# EAGLE board digisim part 1 (EAGLE 9.6.2)
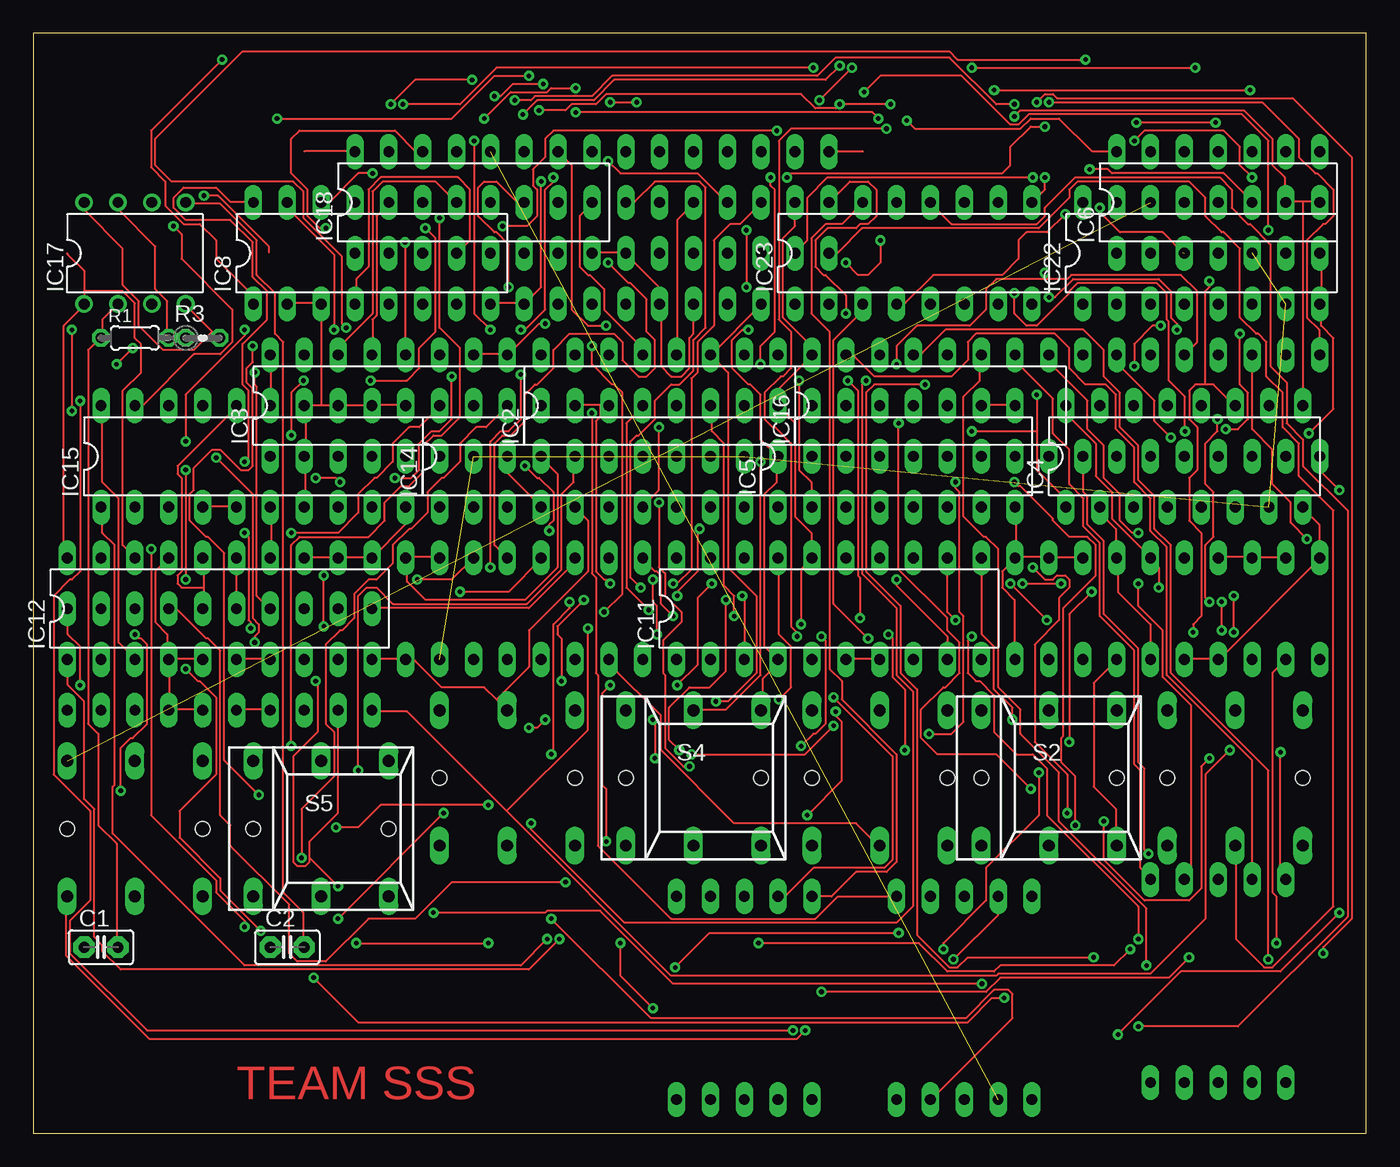
[diagram p3: board, top side]
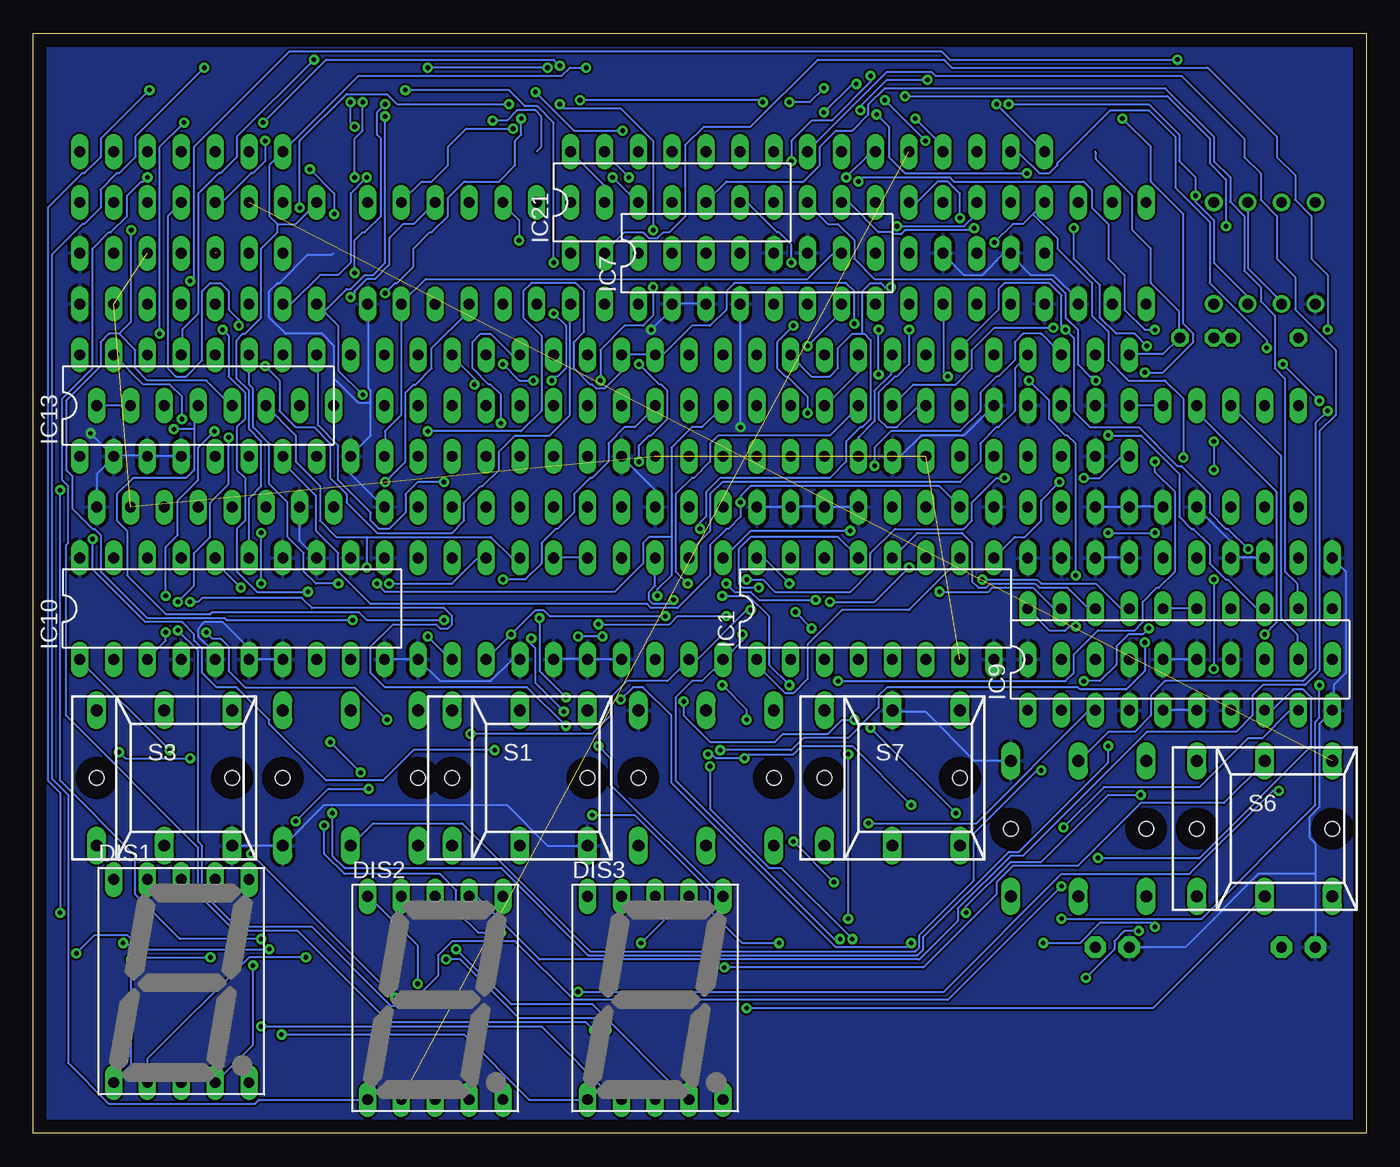
[diagram p4: board, bottom side, seen from below]

Size 100 x 82.54 mm. Coordinates in mm from the lower left corner, seen from the top.
Outline: 0,0 100,0 100,82.54 0,82.54 0,0
Copper layers (1*16): Top 0.035mm / dielectric 1.5mm / Bottom 0.035mm
Design rules "default": minimum track width 6mil, minimum drill 0.35mm, track to track 6mil, track to pad 6mil, pad to pad 6mil, via to via 6mil, smd to smd 6mil, copper to edge 40mil, drill to drill 6mil, minimum pad ring 10mil, minimum via ring 8mil, stop-mask expansion 4mil, vias tented up to drill 0mil, thermal gap 10mil

## Footprints (pad centres in the part's own frame; a part is rotated, then mirrored left to right if it is on the bottom)
C2.5-2 = drill 0.813 pad 1.6 octagon: 1 -1.27,0; 2 1.27,0
HDSP-M = drill 0.813 long: 1 -5.08,-7.62; 2 -2.54,-7.62; 3 0,-7.62; 4 2.54,-7.62; 5 5.08,-7.62; 6 5.08,7.62; 7 2.54,7.62; 8 0,7.62; 9 -2.54,7.62; 10 -5.08,7.62
DIL16 = drill 0.813 long: 1 -8.89,-3.81; 2 -6.35,-3.81; 3 -3.81,-3.81; 4 -1.27,-3.81; 5 1.27,-3.81; 6 3.81,-3.81; 7 6.35,-3.81; 8 8.89,-3.81; 9 8.89,3.81; 10 6.35,3.81; 11 3.81,3.81; 12 1.27,3.81; 13 -1.27,3.81; 14 -3.81,3.81; 15 -6.35,3.81; 16 -8.89,3.81
DIL14 = drill 0.813 long: 1 -7.62,-3.81; 2 -5.08,-3.81; 3 -2.54,-3.81; 4 0,-3.81; 5 2.54,-3.81; 6 5.08,-3.81; 7 7.62,-3.81; 8 7.62,3.81; 9 5.08,3.81; 10 2.54,3.81; 11 0,3.81; 12 -2.54,3.81; 13 -5.08,3.81; 14 -7.62,3.81
DIL20 = drill 0.813 long: 1 -11.43,-3.81; 2 -8.89,-3.81; 3 -6.35,-3.81; 4 -3.81,-3.81; 5 -1.27,-3.81; 6 1.27,-3.81; 7 3.81,-3.81; 8 6.35,-3.81; 9 8.89,-3.81; 10 11.43,-3.81; 11 11.43,3.81; 12 8.89,3.81; 13 6.35,3.81; 14 3.81,3.81; 15 1.27,3.81; 16 -1.27,3.81; 17 -3.81,3.81; 18 -6.35,3.81; 19 -8.89,3.81; 20 -11.43,3.81
DIL08 = drill 0.813 pad 1.27: 1 -3.81,-3.81; 2 -1.27,-3.81; 3 1.27,-3.81; 4 3.81,-3.81; 5 3.81,3.81; 6 1.27,3.81; 7 -1.27,3.81; 8 -3.81,3.81
0204/5 = drill 0.813 octagon: 1 -2.54,0; 2 2.54,0
0204V = drill 0.813 octagon: 1 -1.27,0; 2 1.27,0
REKN = drill 0.9 long: 0A 5.08,5.08; 0B 5.08,-5.08; 1A 0,5.08; 1B 0,-5.08; A -5.08,5.08; B -5.08,-5.08 | hole 1.1: -5.08,0; 5.08,0

## Placement (x,y rotation side)
C1  48.025uF  [C2.5-2]  5.08,13.97 0 top
C2  10nF  [C2.5-2]  19.05,13.97 0 top
DIS1  HD-H101  [HDSP-M]  88.9,11.43 0 bottom
DIS2  HD-H101  [HDSP-M]  69.85,10.16 0 bottom
DIS3  HD-H101  [HDSP-M]  53.34,10.16 0 bottom
IC1  74AC160N  [DIL16]  36.83,39.37 0 bottom
IC2  74AC160N  [DIL16]  46.99,54.61 0 top
IC3  74AC160N  [DIL16]  26.67,54.61 0 top
IC4  74AC160N  [DIL16]  86.36,50.8 0 top
IC5  74AC160N  [DIL16]  64.77,50.8 0 top
IC6  74LS74N  [DIL14]  88.9,69.85 0 top
IC7  4063N  [DIL16]  45.72,66.04 0 bottom
IC8  4063N  [DIL16]  25.4,66.04 0 top
IC9  74AC11157  [DIL20]  13.97,35.56 0 bottom
IC10  74AC11157  [DIL20]  85.09,39.37 0 bottom
IC11  74AC11157  [DIL20]  59.69,39.37 0 top
IC12  74AC11157  [DIL20]  13.97,39.37 0 top
IC13  4063N  [DIL16]  87.63,54.61 0 bottom
IC14  74AC11157  [DIL20]  41.91,50.8 0 top
IC15  74AC11157  [DIL20]  16.51,50.8 0 top
IC16  4055N  [DIL16]  67.31,54.61 0 top
IC17  LM555N  [DIL08]  7.62,66.04 0 top
IC18  4055N  [DIL16]  33.02,69.85 0 top
IC21  74AC11N  [DIL14]  52.07,69.85 0 bottom
IC22  74AC160N  [DIL16]  87.63,66.04 0 top
IC23  4055N  [DIL16]  66.04,66.04 0 top
R1  10K  [0204/5]  7.62,59.69 0 top
R3  1OK  [0204V]  12.7,59.69 0 top
S1  [REKN]  63.5,26.67 0 bottom
S2  [REKN]  76.2,26.67 0 top
S3  [REKN]  90.17,26.67 0 bottom
S4  [REKN]  49.53,26.67 0 top
S5  [REKN]  21.59,22.86 0 top
S6  [REKN]  7.62,22.86 0 bottom
S7  [REKN]  35.56,26.67 0 bottom

## Tracks (layer width: path | path; a pad name or v marks a point on that pad's centre or on a via)
GND  (via drill 0.35)
  Top 0.152: IC18.8 41.91,66.09 44.35,66.09 IC21.7 44.5,65.94 46.94,63.5 46.94,62.28 IC7.4 47.09,62.13 47.09,57.56 47.85,56.79 48.62,56.79 49.23,57.4 49.23,59.69 49.53,60 IC7.3 | IC11.6 60.96,35.61 63.4,35.61 IC11.7 | S4.0A 54.71,31.8 54.71,34.09 55.78,35.15 55.78,35.46 IC11.4 55.78,35.61 54.86,36.52 54.86,47.95 55.78,48.87 55.78,50.7 IC2.8 55.78,50.85 54.56,52.07 54.56,55.42 53.8,56.19 53.65,56.19 52.43,57.4 52.43,59.54 53.19,60.3 v53.65,60.3 | IC6.7 96.62,65.94 96.62,62.28 IC22.8 96.62,62.13 96.62,60.6 97.54,59.69 97.54,54.36 v95.71,52.53 | IC4.8 95.25,46.89 96.47,45.67 96.47,43.23 IC10.20 96.47,43.08 89,35.61 IC10.4 88.85,35.61 86.41,35.61 IC10.5 | 76.2,43.23 73.76,43.23 | 76.2,43.23 78.64,43.23 IC10.13 | 76.2,43.23 IC10.12 | 73.76,43.23 73.76,46.89 IC5.8 | 73.76,43.23 IC10.11 73.61,43.08 72.69,42.16 72.69,40.95 73.61,40.03 73.61,35.61 IC10.10 | IC4.2 80.01,46.58 81.23,45.36 81.23,43.23 IC10.14 81.38,43.08 81.38,40.64 83.82,38.2 IC10.6 | S2.0B 81.23,21.59 81.23,24.33 79.55,26.01 79.55,33.78 81.23,35.46 IC10.7 | 3.81,63.19 3.81,64.72 2.59,65.94 2.54,66.04 | 3.81,63.19 IC17.1 3.81,62.13 2.29,60.6 2.29,43.38 2.44,43.23 IC12.20 | IC8.2 19.05,62.28 21.49,62.28 IC8.3 21.64,62.13 21.64,54.66 | IC8.4 24.23,62.28 24.23,64.11 25.15,65.02 25.15,70.81 26.06,71.73 31.85,71.73 32.77,70.81 32.77,67 31.85,66.09 IC18.4 | IC12.10 25.45,35.61 27.89,35.61 IC1.8 28.04,35.46 28.65,35.46 30.63,33.48 33.83,33.48 34.75,32.56 | S7.1A 34.75,32.56 | IC3.8 35.66,50.7 35.66,49.48 38.1,47.04 IC14.4 | 22.86,43.23 20.42,43.23 IC12.13 | 22.86,43.23 25.3,43.23 IC12.11 27.89,45.67 27.89,46.89 IC15.10
  Top 0.152: 22.86,43.23 IC12.12 | IC15.11 27.89,54.66 25.45,54.66 IC15.12 25.3,54.66 22.86,54.66 | 21.64,54.66 20.42,54.66 IC15.14 20.42,54.51 20.42,50.85 IC3.2 20.42,50.7 20.42,47.04 IC15.7 | 21.64,54.66 22.86,54.66 | 22.86,54.66 IC15.13 | 10.21,31.8 12.65,31.8 IC9.6 | IC9.5 15.24,31.8 17.68,31.8 IC9.4 | IC12.4 10.21,35.61 12.65,35.61 IC12.5 | IC12.6 15.24,35.61 17.68,35.61 IC12.7 | 10.21,31.8 10.21,35.46 IC12.4 | 10.21,31.8 IC9.7 | IC15.4 12.8,47.04 15.24,47.04 IC15.5 | IC12.17 9.14,42.16 9.14,38.35 10.06,37.44 10.06,35.61 IC12.4 | IC12.14 17.83,43.23 17.83,46.89 IC15.6 | 34.75,32.56 37.19,35 37.19,37.74 41.6,42.16 41.6,45.97 40.69,46.89 IC14.5 | 3.81,63.19 6.71,63.19 7.62,62.28 7.62,59.69 8.08,59.23 8.08,57.1 6.71,55.73 6.71,44.14 7.62,43.23 IC12.18 | v46.94,52.98 46.94,48.26 45.72,47.04 IC14.7
  Bottom 0.152: IC7.3 49.53,62.28 51.97,62.28 IC7.2 52.12,62.13 52.12,61.82 v53.65,60.3 | IC14.10 53.34,48.26 IC2.8 | IC11.4 55.93,35.61 58.37,35.61 IC11.5 58.52,35.61 60.96,35.61 IC11.6 | 91.44,50.85 89,50.85 IC13.4 | 91.44,50.85 93.88,50.85 IC13.2 | 91.44,50.85 IC13.3 | IC4.8 95.25,49.48 94.03,50.7 IC13.2 | IC13.2 v95.71,52.53 | S1.0B 61.42,21.59 64.47,24.64 78.18,24.64 81.23,21.59 S2.0B S3.0B | 83.82,35.61 81.38,35.61 IC10.7 | IC10.10 73.61,35.61 71.17,35.61 IC11.10 69.49,33.93 65.68,33.93 64.16,35.46 63.55,35.46 IC11.7 | IC5.8 73.76,47.04 76.2,49.48 IC16.8 76.2,50.85 74.68,52.38 74.68,54.81 | 74.68,54.81 74.68,55.73 74.83,55.88 74.83,62.13 IC23.8 | 74.68,54.81 75.59,54.81 77.42,56.64 77.42,59.08 78.33,60 81.08,60 82.3,61.21 82.3,63.19 81.69,63.8 81.53,63.8 79.4,65.94 77.57,65.94 77.47,66.04 | IC4.2 80.01,44.45 IC10.13 | 83.82,35.61 83.82,36.37 85.8,38.35 87.17,38.35 87.63,37.9 87.63,37.29 86.41,36.07 86.41,35.61 IC10.5 | 83.82,35.61 IC10.6 | IC12.20 1.52,42.16 1.52,34.54 2.44,33.63 2.44,31.8 IC9.10 2.59,31.65 3.5,30.73 3.5,24.49 4.27,23.72 4.27,22.2 3.81,21.74 3.81,19.46 | 3.81,19.46 C1.1 | C2.1 13.56,13.97 8.08,19.46 3.81,19.46 | 26.67,65.94 27.28,65.94 28.8,64.41 30.18,64.41 31.7,65.94 IC18.4 | 26.67,65.94 25.15,64.41 23.47,64.41 21.64,62.59 21.64,62.28 IC8.3 | 26.67,65.94 IC18.2 | S5.0A 26.67,27.99 29.41,27.99 33.07,31.65 35.51,31.65 S7.1A | IC14.7 45.72,47.04 43.28,47.04 IC14.6 43.13,47.04 40.69,47.04 IC14.5 40.54,47.04 38.1,47.04 IC14.4 | IC12.14 17.83,43.23 20.27,43.23 IC12.13 | IC9.6 12.8,31.8 15.24,31.8 IC9.5 | IC12.5 12.8,35.61 15.24,35.61 IC12.6 | IC15.7 20.27,47.04 17.83,47.04 IC15.6 17.68,47.04 15.24,47.04 IC15.5
  Bottom 0.152: IC12.18 7.62,43.23 10.06,43.23 IC12.17 10.21,43.23 10.21,44.45 12.65,46.89 IC15.4 | IC15.11 30.18,52.38 33.38,52.38 34.9,50.85 35.51,50.85 IC3.8 | v46.94,52.98 46.94,62.13 IC7.4
  pour Bottom: 0,82.55 0,0 100.33,0 100.33,82.55
N$8  (1 unrouted)
N$9
  Top 0.152: IC5.10 71.17,54.66 73.61,54.66 IC5.9
N$10  (via drill 0.35)
  Top 0.152: IC1.10 30.48,43.23 28.04,43.23 IC1.9 28.04,43.08 28.04,41.4 29.41,40.03 36.88,40.03 39.32,42.47 39.32,49.48 38.1,50.7 IC2.1 | v21.18,49.17 22.71,49.17 v23.01,48.87 | 95.25,69.9 96.47,69.9 IC22.9 | 95.25,69.9 94.03,69.9 IC22.10 93.88,69.9 93.88,71.73 92.96,72.64 92.96,74.62 90.83,76.76 74.07,76.76 v73.61,76.3 | 95.25,69.9 IC4.9 | v75.29,55.42 75.29,52.68 | 75.29,52.68 75.29,49.78 77.42,47.65 77.42,47.04 IC4.1 | IC3.10 33.07,58.47 35.51,58.47 IC3.9 35.66,58.47 37.95,60.76 v38.41,60.76 | v70.41,52.68 75.29,52.68
  Bottom 0.152: v21.18,49.17 19.96,49.17 18.44,50.7 17.83,50.7 IC3.1 | v23.01,48.87 24.38,47.5 24.38,45.97 25.6,44.76 26.36,44.76 IC1.9 | IC1.1 45.72,35.15 43.59,33.02 42.98,33.02 41.91,34.09 41.91,36.68 39.32,39.27 34.29,39.27 30.48,43.08 IC1.10 | IC4.10 92.81,54.66 95.25,54.66 IC4.9 | v75.29,55.42 77.11,57.25 77.11,60.6 78.18,61.67 | 78.18,61.67 IC22.1 78.64,62.13 | 53.34,58.47 55.78,58.47 IC2.9 55.93,58.32 55.93,57.1 57.15,55.88 57.76,55.88 58.06,56.19 58.22,56.19 59.44,57.4 59.44,59.39 58.67,60.15 58.67,63.19 59.28,63.8 62.64,63.8 63.25,63.19 63.25,61.21 61.87,59.84 61.87,54.2 63.4,52.68 v70.41,52.68 | IC2.1 38.1,52.22 36.88,53.44 36.88,55.73 35.66,56.95 35.66,58.32 IC3.9 | 53.34,58.47 52.73,58.47 50.6,60.6 49.23,60.6 48.01,61.82 48.01,63.19 47.4,63.8 39.01,63.8 38.41,63.19 v38.41,60.76 | 53.34,58.47 IC2.10 | v73.61,76.3 73.61,65.33 74.52,64.41 75.13,64.41 76.2,63.35 76.5,63.35 78.18,61.67
N$11
  Top 0.152: IC1.2 43.28,35.46 43.28,35.15 47.09,31.34 47.09,28.75 52.58,23.27 61.72,23.27 63.4,21.59 S1.1B
N$12  (via drill 0.35)
  Top 0.152: v24.38,27.23 24.38,40.34 24.99,40.95 25.76,40.95 26.98,39.73 37.03,39.73 39.62,42.32 39.62,47.95 40.54,48.87 40.54,50.7 IC2.2
  Bottom 0.152: v24.38,27.23 24.69,27.23 29.41,22.5 29.41,19 33.53,14.88 33.53,13.97 33.83,13.66 58.22,13.66 67.82,23.27 74.52,23.27 S2.1B
N$13
  Top 0.152: IC21.1 59.74,66.09 60.35,66.09 62.18,67.92 75.44,67.92 77.72,70.21 77.72,70.81 78.33,71.42 86.72,71.42 87.94,70.21 87.94,68.83 89.15,67.61 89.31,67.61 90.53,66.4 90.53,61.21 91.75,60 91.9,60 92.51,59.39 92.51,56.79 93.73,55.58 93.73,52.98 94.94,51.77 94.94,49.33 97.54,46.74 97.54,17.02 92.96,12.45 92.35,12.45 90.22,14.58 90.22,21.59 S3.1B
N$14  (via drill 0.35)
  Top 0.152: v55.32,71.73 55.32,71.12 55.63,70.81 55.63,60.15 54.56,59.08 v54.56,57.71 | v54.56,50.39 54.56,34.39 51.97,31.8 49.53,31.8 S4.1A
  Bottom 0.152: v55.32,71.73 57.15,73.56 IC21.13 | v54.56,57.71 53.03,56.19 52.88,56.19 52.43,55.73 52.43,53.59 53.65,52.38 53.8,52.38 54.56,51.61 v54.56,50.39
N$15  (via drill 0.35)
  Top 0.152: IC9.20 25.45,39.42 37.19,39.42 40.54,42.77 40.54,43.08 IC1.14 | v29.41,67.92 30.18,67.16 30.18,60.15 28.96,58.93 28.96,57.4 28.04,56.49 v25.3,56.49 | v21.79,38.05 v21.79,41.86
  Bottom 0.152: v29.41,67.92 29.57,67.77 34.59,67.77 34.9,67.46 35.51,67.46 35.66,67.61 36.58,67.61 38.71,69.75 39.32,69.75 IC7.10 | v25.3,56.49 23.77,54.97 23.77,53.59 22.55,52.38 22.4,52.38 21.79,51.77 v21.79,41.86 | v21.79,38.05 22.25,38.05 22.55,37.74 23.77,37.74 IC9.20
N$16  (via drill 0.35)
  Top 0.152: v32,40.64 35.66,40.64 38.1,43.08 IC1.13 | v45.57,40.95 44.81,41.71 44.81,51.92 45.26,52.38 45.41,52.38 46.63,53.59 46.63,54.97 47.85,56.19 48.46,56.19 49.53,57.25 49.53,59.54 50.44,60.45 50.44,70.97 49.99,71.42 46.63,71.42 45.11,69.9 44.5,69.9 IC7.12
  Bottom 0.152: v32,40.64 28.35,40.64 28.04,40.95 24.99,40.95 23.47,39.42 22.86,39.42 IC9.19 | v45.57,40.95 46.79,40.95 47.09,41.25 47.09,43.84 46.18,44.76 39.62,44.76 38.1,43.23 IC1.13
N$17  (via drill 0.35)
  Top 0.152: v43.13,65.33 44.65,63.8 44.81,63.8 46.02,62.59 46.02,60.15 46.63,59.54 46.63,57.4 46.02,56.79 45.41,56.79 44.2,58.01 44.2,59.39 43.59,60 40.23,60 39.01,58.78 39.01,57.4 37.8,56.19 37.64,56.19 36.88,55.42 36.88,53.44 35.81,52.38 35.2,52.38 34.59,51.77 34.59,44.14 IC1.12
  Bottom 0.152: IC1.12 33.68,45.06 30.33,45.06 29.57,44.3 29.57,41.4 29.11,40.95 28.5,40.95 28.19,41.25 24.84,41.25 24.54,40.95 22.4,40.95 20.88,39.42 20.42,39.42 IC9.18 | v43.13,65.33 43.13,66.7 44.04,67.61 44.2,67.61 46.33,69.75 46.94,69.75 IC7.13
N$18  (via drill 0.35)
  Top 0.152: v28.8,41.55 31.39,41.55 IC1.11 | v43.13,72.95 44.04,72.03 49.84,72.03 51.97,69.9 IC7.15 | v37.19,79.35 34.59,79.35 31.39,76.15 v18.29,76.15 | v16.61,57.1 16.61,56.19 16.76,56.03 16.76,40.34 17.68,39.42 IC9.17
  Bottom 0.152: v28.8,41.55 24.69,41.55 24.38,41.25 20.27,41.25 18.44,39.42 17.83,39.42 IC9.17 | v43.13,72.95 43.13,74.47 41.6,76 40.08,76 37.19,78.89 v37.19,79.35 | v18.29,76.15 16.15,74.02 16.15,71.42 13.72,68.99 13.72,60.76 12.95,60 12.95,59.39 15.24,57.1 v16.61,57.1
N$19  (via drill 0.35)
  Top 0.152: v39.93,18.85 31.39,18.85 28.65,16.1 25.15,16.1 21.95,12.9 19.81,12.9 19.2,13.51 19.2,17.17 14.78,21.59 14.78,23.11 14.02,23.88 14.02,36.22 13.11,37.13 12.95,37.13 10.82,39.27 10.21,39.27 IC9.14 | v42.98,21.89 42.98,25.86 42.67,26.16 42.67,33.02 v43.28,33.63 | v48.31,40.34 48.31,40.64 49.84,42.16 49.84,45.21 v49.99,45.36 | v35.66,63.5 35.66,66.7 34.75,67.61 34.59,67.61 33.38,68.83 33.38,70.97 33.83,71.42 34.75,71.42 36.27,69.9 36.73,69.9 IC7.9
  Bottom 0.152: v42.98,21.89 v39.93,18.85 | v43.28,33.63 44.81,35.15 44.81,38.81 46.33,40.34 v48.31,40.34 | v49.99,45.36 49.99,45.82 49.53,46.28 49.53,48.11 48.46,49.17 40.23,49.17 39.01,50.39 39.01,51.92 37.95,52.98 37.8,52.98 37.19,53.59 37.19,59.54 37.64,60 37.8,60 | 37.8,60 38.56,60 39.62,58.93 39.62,57.4 40.23,56.79 41.6,56.79 43.13,58.32 IC2.14 | v35.66,63.5 36.12,63.5 36.42,63.8 37.19,63.8 37.8,63.19 37.8,60
N$20  (via drill 0.35)
  Top 0.152: v19.36,52.38 19.36,55.58 v20.27,56.49 | IC2.13 45.72,58.93 42.82,61.82 42.82,63.35 41.76,64.41 41.6,64.41 41,65.02 41,68.83 41.91,69.75 IC7.11
  Bottom 0.152: v19.36,52.38 16.92,52.38 14.02,49.48 14.02,46.28 13.11,45.36 12.95,45.36 11.73,44.14 11.73,42.77 10.52,41.55 10.36,41.55 8.23,39.42 7.62,39.42 IC9.13 | v20.27,56.49 20.57,56.79 20.73,56.79 21.64,57.71 21.64,60.3 22.55,61.21 22.55,63.04 23.62,64.11 36.88,64.11 38.41,65.63 38.41,67 39.62,68.22 40.39,68.22 41.91,69.75 IC7.11
N$21
  Top 0.152: IC2.12 48.31,58.47 48.31,68.53 49.53,69.75 IC7.14
  Bottom 0.152: IC9.12 5.18,39.42 5.18,41.25 6.1,42.16 6.1,56.64 6.86,57.4 6.86,61.37 7.92,62.43 7.92,63.5 9.14,64.72 9.14,68.83 10.21,69.9 10.21,71.73 11.43,72.95 11.43,74.78 15.09,78.44 36.12,78.44 37.34,77.22 37.34,76.45 38.56,75.23 39.78,75.23 41,74.02 41,72.64 42.22,71.42 48.01,71.42 49.53,69.9 IC7.14
N$22  (via drill 0.35)
  Top 0.152: v3.5,33.63 3.5,36.52 2.59,37.44 2.59,39.27 IC9.11 | v30.79,24.03 v22.86,16.1 | v37.19,30.43 37.8,30.43 v38.41,31.04 | v51.21,32.41 52.12,32.41 54.25,34.54 54.25,40.34 52.12,42.47 52.12,57.1 IC2.11 50.9,58.47 54.56,62.13 IC7.1
  Bottom 0.152: v3.5,33.63 3.5,31.19 3.81,30.89 3.81,24.64 12.34,16.1 v22.86,16.1 | v37.19,30.43 v30.79,24.03 | v38.41,31.04 39.32,31.04 40.39,29.97 43.74,29.97 44.35,29.36 49.23,29.36 51.21,31.34 v51.21,32.41
N$23  (via drill 0.35)
  Top 0.152: 35.51,24.18 47.85,11.84 72.24,11.84 72.39,11.99 83.82,11.99 87.94,16.1 87.94,26.92 v89.76,28.75 | 35.51,24.18 28.04,31.65 25.45,31.65 IC9.1 | v41.91,59.08 41.91,57.71 43.43,56.19 43.59,56.19 44.2,55.58 44.2,40.49 v42.82,39.12 | v41.6,37.9 41.6,30.28 35.51,24.18
  Bottom 0.152: v89.76,28.75 96.47,35.46 IC10.1 | v41.91,59.08 39.47,61.52 39.47,62.13 IC7.7 | v41.6,37.9 v42.82,39.12
N$24  (via drill 0.35)
  Top 0.152: IC3.14 22.86,58.93 25.45,61.52 25.45,70.66 26.21,71.42 30.18,71.42 IC8.10 | v38.71,45.21 38.71,45.67 39.01,45.97 39.01,48.11 37.95,49.17 37.8,49.17 v36.88,50.09
  Bottom 0.152: v38.71,45.21 46.18,45.21 48.16,43.23 IC11.20 | v36.88,50.09 36.88,51.46 35.66,52.68 30.48,52.68 28.96,54.2 28.96,55.58 27.74,56.79 27.58,56.79 26.36,58.01 26.36,59.39 25.76,60 24.38,60 22.86,58.47 IC3.14
N$25
  Top 0.152: IC3.13 25.45,58.47 25.45,61.06 25.76,61.37 25.76,68.83 26.67,69.75 IC8.12
  Bottom 0.152: IC11.19 50.75,43.23 50.75,43.69 49.23,45.21 49.23,47.95 48.31,48.87 30.48,48.87 28.96,50.39 28.96,51.77 27.74,52.98 27.58,52.98 26.36,54.2 26.36,57.4 25.45,58.32 IC3.13
N$26  (via drill 0.35)
  Top 0.152: v27.89,66.85 27.89,58.47 IC3.12 | v51.97,40.03 51.97,34.7 50.75,33.48 49.23,33.48 47.7,31.95 47.7,29.52 v48.46,28.75 | v16.61,36.83 16.61,37.29 16.92,37.59 16.92,38.2 16.46,38.66 16.46,47.95 v13.72,50.7
  Bottom 0.152: v27.89,66.85 26.52,68.22 25.76,68.22 24.99,68.99 | IC8.13 24.99,68.99 | IC11.18 53.34,41.1 53.8,40.64 53.8,40.03 53.49,39.73 52.27,39.73 v51.97,40.03 | v48.46,28.75 43.13,28.75 42.22,29.67 38.86,29.67 36.58,31.95 36.58,32.87 35.97,33.48 21.64,33.48 21.49,33.33 17.98,33.33 16.61,34.7 v16.61,36.83 | v13.72,50.7 13.72,55.12 15.09,56.49 17.83,56.49 19.36,58.01 19.36,60.15 20.57,61.37 20.57,63.8 23.16,66.4 23.16,67.16 24.99,68.99
N$27  (via drill 0.35)
  Top 0.152: v22.55,60.3 22.55,65.94 19.05,69.44 IC8.15 | v55.93,32.56 56.84,33.48 56.84,36.52 55.93,37.44 55.93,43.08 IC11.17 | v24.23,14.27 v34.14,14.27 | v15.85,15.49 15.85,15.95 13.72,18.09 13.72,19 8.84,23.88 v8.84,43.84
  Bottom 0.152: IC3.11 30.48,58.93 27.58,61.82 27.58,63.35 27.13,63.8 23.77,63.8 22.86,62.89 22.86,60.6 v22.55,60.3 21.95,59.69 21.95,54.2 20.73,52.98 17.07,52.98 14.17,50.09 13.87,50.09 11.73,47.95 11.73,46.58 10.52,45.36 10.36,45.36 v8.84,43.84 | v55.93,32.56 55.02,33.48 54.25,33.48 52.12,31.34 52.12,26.31 39.78,13.97 34.44,13.97 v34.14,14.27 | v24.23,14.27 21.49,14.27 19.96,15.8 16.15,15.8 v15.85,15.49
N$28  (via drill 0.35)
  Top 0.152: v30.48,68.68 30.48,60.45 32,58.93 32,53.75 30.63,52.38 30.02,52.38 29.26,51.61 29.26,49.63 28.19,48.56 27.58,48.56 26.36,47.35 26.36,45.97 25.15,44.76 19.96,44.76 19.36,44.14 v19.36,29.06 | v77.57,24.03 77.57,26.92 75.13,29.36 75.13,36.68 76.96,38.51 76.96,40.18 77.72,40.95 77.72,41.55 77.42,41.86 76.81,41.86 76.5,41.55 75.89,41.55 v74.98,42.47
  Bottom 0.152: 74.98,44.76 77.27,44.76 78.49,45.97 78.49,48.56 80.31,50.39 80.31,52.38 IC4.14 | 74.98,44.76 65.68,44.76 64.16,43.23 63.55,43.23 IC11.14 | v30.48,68.68 30.48,70.51 31.39,71.42 32.16,71.42 33.68,69.9 34.29,69.9 IC8.9 | v19.36,29.06 19.36,27.84 26.06,21.13 26.82,21.13 33.22,14.73 33.22,13.82 33.68,13.36 58.37,13.36 64.92,19.91 76.66,19.91 77.57,20.83 v77.57,24.03 | 74.98,44.76 v74.98,42.47
N$29  (via drill 0.35)
  Top 0.152: v76.05,38.51 v73.3,41.25 | v35.2,68.07 37.03,68.07 37.8,68.83 37.8,70.81 37.49,71.12 37.49,72.34 38.41,73.25 38.41,74.62 39.01,75.23 v55.78,75.23 | v62.33,78.13 63.55,79.35 69.65,79.35 73.3,75.69 73.91,75.69 74.68,76.45 90.68,76.45 92.66,74.47 v92.66,67.77
  Bottom 0.152: v73.3,41.25 68.58,41.25 66.75,43.08 66.14,43.08 IC11.13 | v76.05,38.51 85.5,38.51 85.65,38.66 91.44,38.66 94.94,42.16 94.94,44.91 95.4,45.36 95.56,45.36 97.08,46.89 97.08,49.33 97.54,49.78 97.54,54.97 94.94,57.56 94.94,59.39 94.34,60 93.57,60 | 93.57,60 92.35,58.78 92.35,57.4 91.44,56.49 87.02,56.49 85.19,54.66 IC4.13 | v35.2,68.07 30.18,68.07 29.26,68.99 29.26,69.75 IC8.11 | v55.78,75.23 59.44,75.23 v62.33,78.13 | v92.66,67.77 92.66,60.91 93.57,60
N$30  (via drill 0.35)
  Top 0.152: IC11.12 68.58,39.12 v69.19,38.51 | v25.45,72.03 24.38,72.03 22.25,69.9 21.64,69.9 IC8.14 | v36.73,76.45 37.8,77.52 42.06,77.52 43.59,79.05 59.44,79.05 v60.5,80.11 | v88.7,75.84 v82.75,75.84 | v90.53,60 90.53,56.19 91.14,55.58 91.14,53.59 90.37,52.83 v89.46,52.83
  Bottom 0.152: v69.19,38.51 74.98,38.51 75.59,39.12 86.56,39.12 86.72,38.96 90.07,38.96 92.96,41.86 92.96,45.21 93.73,45.97 93.73,47.95 92.51,49.17 88.54,49.17 87.94,49.78 87.94,52.83 | 87.94,52.83 87.94,54.2 87.63,54.51 IC4.12 | v25.45,72.03 34.59,72.03 35.81,73.25 35.81,75.54 v36.73,76.45 | v60.5,80.11 60.96,80.57 78.03,80.57 v82.75,75.84 | v88.7,75.84 90.53,74.02 v90.53,60 | 87.94,52.83 v89.46,52.83
N$31  (via drill 0.35)
  Top 0.152: v73.46,31.04 73.46,31.95 72.08,33.33 72.08,36.52 71.17,37.44 71.17,43.08 IC11.11 | v87.02,37.59 87.02,38.2 87.63,38.81 87.63,45.06 86.72,45.97 86.72,49.17 87.33,49.78 87.33,52.98 86.72,53.59 86.72,55.73 87.17,56.19 87.94,56.19 | 87.94,56.19 88.54,56.19 90.07,54.66 IC4.11 | v14.17,80.57 8.84,75.23 8.84,72.49 9.91,71.42 9.91,69.6 11.28,68.22 12.5,68.22 13.72,67 13.72,65.63 16.46,62.89 16.46,62.28 IC8.1 | v88.24,63.96 88.24,63.5 87.94,63.19 87.94,56.19
  Bottom 0.152: v73.46,31.04 75.89,33.48 84.12,33.48 85.34,34.7 85.34,36.52 85.95,37.13 86.56,37.13 v87.02,37.59 | v14.17,80.57 31.24,80.57 31.85,81.18 80.77,81.18 87.94,74.02 87.94,64.26 v88.24,63.96
N$32
  Top 0.152: 91.44,43.23 89,43.23 IC10.17 | 91.44,43.23 93.88,43.23 IC10.19 | 91.44,43.23 IC10.18
N$33  (via drill 0.35)
  Top 0.152: v39.47,14.58 37.19,12.29 6.55,12.29 5.18,13.66 5.18,14.12 4.57,14.73 4.57,24.33 3.81,25.09 3.81,32.41 2.59,33.63 2.59,35.46 IC12.1 | v31.39,56.79 31.39,53.59 30.48,52.68 29.87,52.68 28.96,51.77 28.96,49.78 28.35,49.17 v27.13,49.17 | v46.48,41.55 46.48,39.88 46.79,39.57 v46.79,37.44
  Bottom 0.152: v39.47,14.58 39.93,14.58 51.82,26.47 51.82,32.71 50.6,33.93 49.84,33.93 48.31,35.46 IC11.1 48.16,35.61 46.79,36.98 v46.79,37.44 | v31.39,56.79 31.7,57.1 31.7,62.13 IC8.7 | v27.13,49.17 27.74,49.17 29.57,47.35 29.57,45.97 30.18,45.36 35.36,45.36 37.19,43.54 37.19,42.16 38.71,40.64 44.35,40.64 45.26,41.55 v46.48,41.55
N$35  (via drill 0.35)
  Top 0.152: IC9.2 22.86,24.03 20.73,21.89 20.73,20.68 | 20.73,20.68 20.73,20.37 20.42,20.07 19.81,20.07 19.51,20.37 19.51,28.3 21.34,30.12 21.34,33.78 v21.18,33.93 | v16.31,37.9 16.31,38.35 16.15,38.51 16.15,44.76 v15.85,45.06 | v19.36,45.06 22.86,45.06 24.38,46.58 24.38,47.95 25.6,49.17 25.76,49.17 26.98,50.39 26.98,51.77 28.19,52.98 28.96,52.98 30.48,54.51 IC14.20 | v85.34,52.22 84.12,53.44 84.12,54.97 81.38,57.71 81.38,58.32 IC13.10 | v89.15,37.74 v89.15,39.88 | 20.73,20.68 v22.86,18.54
  Bottom 0.152: v21.18,33.93 19.96,33.93 18.75,35.15 18.75,36.52 17.83,37.44 16.76,37.44 v16.31,37.9 | v19.36,45.06 v15.85,45.06 | v85.34,52.22 85.34,48.72 86.72,47.35 86.72,44.76 87.94,43.54 87.94,41.1 v89.15,39.88 | v89.15,37.74 87.63,36.22 87.63,21.89 87.33,21.59 87.33,18.09 84.73,15.49 79.1,15.49 73.15,9.55 71.93,9.55 69.65,11.84 69.65,13.36 68.58,14.43 63.86,14.43 59.44,10.01 31.39,10.01 v22.86,18.54
N$36  (via drill 0.35)
  Top 0.152: v37.34,23.27 37.34,22.81 44.35,15.8 64.77,15.8 65.99,17.02 65.99,33.17 64.77,34.39 64.77,39.42 62.18,42.01 62.18,56.19 v62.48,56.49 | v64.77,57.71 64.77,59.08 66.29,60.6 70.26,60.6 71.48,61.82 71.48,63.35 72.24,64.11 75.89,64.11 | 75.89,64.11 77.57,64.11 77.88,64.41 86.11,64.41 87.33,63.19 87.33,59.39 IC13.12 | v34.29,60.3 33.07,61.52 v33.07,74.47 | v36.12,77.52 37.34,77.52 37.64,77.83 41.91,77.83 43.43,79.35 58.83,79.35 60.2,80.72 68.73,80.72 72.24,77.22 v73.61,77.22 | 75.89,64.11 v75.89,64.57
  Bottom 0.152: v37.34,23.27 29.26,23.27 20.88,31.65 20.42,31.65 IC9.3 | v62.48,56.49 63.55,56.49 v64.77,57.71 | v34.29,60.3 34.29,57.71 35.2,56.79 35.36,56.79 36.58,55.58 36.58,53.59 35.97,52.98 35.2,52.98 33.68,54.51 33.07,54.51 IC14.19 | v36.12,77.52 v33.07,74.47 | v73.61,77.22 74.22,76.61 74.22,74.93 73.91,74.62 73.91,68.83 75.13,67.61 75.29,67.61 75.89,67 v75.89,64.57
N$37  (via drill 0.35)
  Top 0.152: v20.12,20.68 20.12,24.33 22.55,26.77 22.55,30.12 21.95,30.73 21.95,36.68 23.01,37.74 23.16,37.74 24.08,38.66 24.08,40.49 25.15,41.55 25.76,41.55 26.98,42.77 26.98,44.14 28.19,45.36 28.35,45.36 29.57,46.58 29.57,48.11 30.63,49.17 30.79,49.17 32,50.39 32,51.77 33.22,52.98 33.98,52.98 35.51,54.51 IC14.18 | v78.94,80.57 69.34,80.57 68.73,81.18 15.7,81.18 9.14,74.62 9.14,72.64 10.36,71.42 19.51,71.42 20.27,70.66 20.27,68.68 23.16,65.79 23.16,60.76 v23.47,60.45
  Bottom 0.152: v20.12,20.68 12.5,20.68 4.12,29.06 4.12,32.71 4.72,33.33 5.49,33.33 7.01,31.8 7.62,31.8 IC9.8 | v78.94,80.57 84.73,74.78 84.73,73.25 85.95,72.03 86.11,72.03 87.63,70.51 87.63,61.52 88.85,60.3 88.85,58.47 IC13.13 | v23.47,60.45 27.89,60.45 29.57,58.78 29.57,57.4 30.79,56.19 33.98,56.19 IC14.18
N$38  (via drill 0.35)
  Top 0.152: v22.71,22.96 24.38,22.96 26.06,24.64 v34.14,24.64 | v46.63,28.14 46.63,30.89 v46.48,31.04 | v48.31,33.63 49.84,35.15 49.84,40.18 v50.9,41.25 | v88.85,53.59 88.85,52.68 87.94,51.77 87.94,48.72 88.54,48.11 88.54,44.76 87.94,44.14 87.94,40.18 v88.24,39.88 | v60.05,30.58 57.91,28.45 v49.38,28.45
  Bottom 0.152: v22.71,22.96 19.66,26.01 12.5,26.01 8.84,29.67 7.77,29.67 5.79,31.65 5.18,31.65 IC9.9 | v34.14,24.64 38.56,29.06 42.37,29.06 42.98,28.45 46.33,28.45 v46.63,28.14 48.77,28.14 49.07,28.45 v49.38,28.45 | v46.48,31.04 46.48,31.8 v48.31,33.63 | v50.9,41.25 51.82,42.16 51.82,47.95 50.6,49.17 50.44,49.17 49.23,50.39 49.23,51.77 48.62,52.38 40.23,52.38 38.1,54.51 IC14.17 | IC13.15 91.75,56.19 89.76,56.19 88.85,55.27 v88.85,53.59 | v88.24,39.88 87.63,39.88 87.33,40.18 79.86,40.18 79.1,39.42 69.19,39.42 68.58,38.81 68.58,38.2 68.89,37.9 69.49,37.9 69.8,38.2 73,38.2 74.68,36.52 74.68,34.54 73.61,33.48 62.94,33.48 v60.05,30.58
N$39  (via drill 0.35)
  Top 0.152: v46.18,39.27 44.5,40.95 44.5,53.29 45.72,54.51 IC14.14 | v69.19,48.87 69.19,48.41 69.49,48.11 69.49,39.12 69.8,38.81 69.8,30.89 68.89,29.97 v67.21,29.97
  Bottom 0.152: v46.18,39.27 46.48,39.27 50.14,35.61 50.75,35.61 IC11.2 52.43,33.93 55.47,33.93 56.69,32.71 56.69,31.34 58.06,29.97 v67.21,29.97 | v69.19,48.87 71.17,48.87 72.08,47.95 72.08,46.58 73.3,45.36 74.07,45.36 74.68,45.97 74.68,46.58 77.11,49.02 77.11,51.61 78.64,53.14 78.64,58.32 IC13.9
N$40  (via drill 0.35)
  Top 0.152: IC11.3 53.34,40.18 v53.19,40.34 | v74.22,41.25 v77.11,41.25
  Bottom 0.152: v53.19,40.34 53.19,40.79 52.12,41.86 52.12,44.76 | 52.12,44.76 52.12,51.46 50.6,52.98 49.84,52.98 48.31,54.51 IC14.13 | IC13.11 83.82,56.19 83.52,55.88 83.52,52.98 82.3,51.77 82.3,48.72 80.92,47.35 80.92,44.76 79.7,43.54 79.7,42.16 78.79,41.25 v77.11,41.25 | v74.22,41.25 73.61,40.64 56.39,40.64 54.25,42.77 54.25,44.3 53.8,44.76 52.12,44.76
N$42  (5 unrouted)
N$43
  Bottom 0.152: IC15.18 6.4,50.85 6.4,38.66 5.18,37.44 5.18,35.61 IC12.2
N$44  (via drill 0.35)
  Top 0.152: v38.56,14.58 36.58,12.6 15.85,12.6 5.94,22.5 5.94,26.01 6.1,26.16 6.1,44.14 5.18,45.06 5.18,46.89 IC15.1 | v49.23,27.53 48.77,27.53 47.4,28.91 47.4,34.39 47.24,34.54 47.24,36.98 48.62,38.35 48.62,39.12 47.4,40.34 47.4,42.01 46.94,42.47 v46.94,47.35
  Bottom 0.152: v38.56,14.58 43.89,19.91 44.81,19.91 49.23,24.33 v49.23,27.53 | IC14.1 30.48,47.04 32,48.56 46.18,48.56 46.94,47.8 v46.94,47.35 46.94,46.28 47.85,45.36 48.01,45.36 49.23,44.14 49.23,41.86 51.66,39.42 53.65,39.42 53.95,39.73 74.68,39.73 77.11,42.16 77.11,43.54 78.79,45.21 78.79,47.8 81.23,50.24 81.23,50.7 IC13.7
N$45  (via drill 0.35)
  Top 0.152: v7.62,37.44 7.92,37.13 8.08,37.13 8.53,36.68 8.53,30.73 7.47,29.67 7.32,29.67 6.55,28.91 v6.55,25.7 | v59.13,10.62 71.48,10.62 72.54,11.68 85.19,11.68 v86.72,13.21 | v93.27,14.27 93.27,17.78 92.96,18.09 92.96,34.54 IC10.2
  Bottom 0.152: v7.62,37.44 6.71,38.35 6.71,48.11 12.65,54.05 12.65,54.51 IC15.17 | v6.55,25.7 7.01,25.7 13.26,19.46 22.86,19.46 31.7,10.62 v59.13,10.62 | v86.72,13.21 91.9,13.21 92.96,14.27 v93.27,14.27
N$46  (via drill 0.35)
  Top 0.152: v10.52,68.07 11.12,67.46 11.12,65.63 14.94,61.82 14.94,59.39 14.02,58.47 12.04,58.47 8.23,54.66 7.62,54.66 IC15.19 | v34.59,77.83 35.05,77.83 35.97,78.74 v38.25,78.74 | v40.69,76.61 62.94,76.61 v63.4,76.15 | v73.61,63.04 73.61,61.52 74.52,60.6 75.29,60.6 77.72,63.04 77.72,63.19 78.33,63.8 84.28,63.8 85.04,63.04 85.04,61.06 85.19,60.91 85.19,56.49 86.41,55.27 v86.41,52.68 | v90.07,37.59 v90.07,40.34
  Bottom 0.152: v10.52,68.07 10.52,71.58 11.73,72.8 11.73,74.62 14.94,77.83 v34.59,77.83 | v38.25,78.74 38.56,78.74 v40.69,76.61 | v63.4,76.15 63.4,74.93 63.86,74.47 63.86,72.64 65.08,71.42 67.67,71.42 68.89,70.21 68.89,68.83 70.1,67.61 70.26,67.61 71.48,66.4 71.48,65.02 72.69,63.8 72.85,63.8 v73.61,63.04 | v86.41,52.68 87.63,51.46 87.63,49.02 89.15,47.5 89.15,44.91 90.07,43.99 v90.07,40.34 | v90.07,37.59 90.07,36.98 91.44,35.61 IC10.3
N$47
  Top 0.152: IC15.20 5.18,54.51 5.18,48.87 6.4,47.65 6.4,36.83 7.62,35.61 IC12.3
N$61  (via drill 0.35)
  Top 0.152: IC16.9 76.2,57.86 79.1,54.97 79.1,52.83 80.31,51.61 80.31,49.17 81.53,47.95 81.53,45.97 82.45,45.06 v82.91,45.06 | v82.91,41.25 82.91,39.57 84.73,37.74 84.73,34.24 86.87,32.11 86.87,19.61 86.41,19.15 DIS1.7
  Bottom 0.152: v82.91,41.25 v82.91,45.06
N$62
  Top 0.152: IC16.10 73.76,58.32 73.76,57.86 76.5,55.12 76.5,52.53 77.72,51.31 77.72,48.72 78.79,47.65 78.79,45.52 80.01,44.3 80.01,38.81 82.6,36.22 82.6,27.69 83.06,27.23 83.06,19.91 83.82,19.15 DIS1.6
N$63  (via drill 0.35)
  Top 0.152: v83.52,12.6 83.52,16.87 76.96,23.42 76.96,27.08 74.07,29.97 74.07,31.8 72.39,33.48 72.39,43.84 71.48,44.76 71.32,44.76 69.8,46.28 69.8,55.27 71.02,56.49 71.02,58.32 IC16.11
  Bottom 0.152: v83.52,12.6 83.52,6.65 DIS1.4
N$64  (via drill 0.35)
  Top 0.152: v79.55,13.21 70.1,13.21 69.34,12.45 68.73,12.45 66.29,14.88 66.29,33.33 65.08,34.54 65.08,39.57 62.48,42.16 62.48,55.58 63.09,56.19 v66.9,56.19
  Bottom 0.152: DIS1.2 91.44,5.59 83.82,13.21 v79.55,13.21 | v66.9,56.19 66.9,56.64 68.58,58.32 IC16.12
N$65  (via drill 0.35)
  Top 0.152: v92.66,13.06 92.66,27.23 85.34,34.54 85.34,44.14 84.12,45.36 84.12,47.8 82.91,49.02 82.91,51.61 81.53,52.98 81.53,55.58 80.31,56.79 80.31,58.78 78.79,60.3 68.43,60.3 66.6,58.47 66.14,58.47 IC16.13
  Bottom 0.152: v92.66,13.06 92.66,5.13 DIS1.1
N$66
  Top 0.152: DIS1.9 91.44,27.99 85.04,34.39 85.04,43.99 83.82,45.21 83.82,47.65 82.6,48.87 82.6,51.46 81.23,52.83 81.23,55.42 80.47,56.19 78.94,56.19 77.72,57.4 77.72,58.93 76.66,60 70.71,60 70.1,59.39 70.1,58.01 68.89,56.79 63.09,56.79 61.57,58.32 60.96,58.32 IC16.15
N$67  (via drill 0.35)
  Top 0.152: v64.92,53.29 64.92,42.32 68.58,38.66 68.58,37.74 69.49,36.83 69.49,34.54 68.43,33.48 68.28,33.48 66.6,31.8 66.6,29.67 67.82,28.45 72.24,28.45 v74.83,25.86 | v80.31,23.42 80.31,20.52 83.36,17.47 86.72,17.47 87.63,18.39 87.63,27.53 v88.24,28.14 | v93.57,28.6 93.57,19.46 DIS1.10
  Bottom 0.152: v64.92,53.29 64.92,55.42 65.68,56.19 65.84,56.19 67.06,57.4 67.06,59.39 66.45,60 65.68,60 64.16,58.47 63.55,58.47 IC16.14 | v74.83,25.86 77.88,25.86 v80.31,23.42 | v88.24,28.14 93.12,28.14 v93.57,28.6
N$68
  Bottom 0.152: DIS2.7 66.75,17.78 62.03,13.06 33.53,13.06 30.63,15.95 30.63,16.87 26.67,20.83 25.76,20.83 16.46,30.12 9.75,30.12 8.53,31.34 8.53,32.87 7.77,33.63 4.57,33.63 3.5,34.7 3.5,52.68 2.29,53.9 2.29,58.78 5.33,61.82 5.33,64.26 6.71,65.63 6.71,68.83 7.92,70.05 7.92,72.03 9.14,73.25 9.14,74.62 13.87,79.35 32.31,79.35 32.61,79.65 35.97,79.65 41.91,73.71 IC18.9
N$69  (via drill 0.35)
  Top 0.152: DIS2.6 60.35,17.78 58.67,16.1 47.85,16.1 42.37,21.59 42.37,34.39 42.22,34.54 42.22,41.71 41.91,42.01 v41.91,54.05 | v42.98,60.6 41.6,60.6 40.39,61.82 40.39,72.64 IC18.10
  Bottom 0.152: v41.91,54.05 41.91,55.27 43.43,56.79 43.59,56.79 44.2,57.4 44.2,59.39 v42.98,60.6
N$70  (via drill 0.35)
  Top 0.152: IC11.9 68.58,37.29 64.77,41.1 v64.77,41.55 | v97.99,48.26 96.62,49.63 96.62,50.7 IC13.1 | v82.91,14.58 82.91,17.02 76.05,23.88 76.05,27.38 74.98,28.45 73.76,28.45 72.08,30.12 72.08,32.87 71.02,33.93 70.71,33.93 70.1,34.54 70.1,36.98 v70.41,37.29
  Bottom 0.152: v64.77,41.55 63.09,41.55 61.87,42.77 61.87,44.3 60.81,45.36 60.66,45.36 59.44,46.58 59.44,47.95 58.22,49.17 58.06,49.17 56.84,50.39 56.84,51.77 55.63,52.98 54.86,52.98 53.34,54.51 IC14.11 | v97.99,48.26 97.99,26.47 92.35,20.83 92.35,17.93 89,14.58 v82.91,14.58 | v70.41,37.29 68.58,35.46 IC11.9
N$71  (via drill 0.35)
  Top 0.152: v52.58,38.81 52.58,40.34 51.82,41.1 51.82,51.77 50.9,52.68 50.9,54.51 IC14.12 | IC13.14 91.44,52.83 92.96,51.31 92.96,48.72 94.34,47.35 94.34,45.82 v95.56,44.6 | v65.38,28.75 65.38,33.33 64.47,34.24 64.47,37.13 v64.16,37.44
  Bottom 0.152: v52.58,38.81 61.27,38.81 61.72,39.27 62.33,39.27 v64.16,37.44 IC11.8 | v95.56,44.6 95.56,42.32 91.59,38.35 88.85,38.35 87.94,37.44 87.94,36.98 87.33,36.37 87.33,34.54 86.26,33.48 84.73,33.48 82.3,31.04 82.3,30.73 78.03,26.47 73.76,26.47 71.48,28.75 v65.38,28.75
N$79  (via drill 0.35)
  Top 0.152: v74.98,71.73 59.59,71.73 58.06,70.21 58.06,67 57.15,66.09 IC21.2 | v2.9,60.3 v2.9,54.2
  Bottom 0.152: v74.98,71.73 76.2,70.51 76.2,65.33 77.11,64.41 78.49,64.41 80.62,62.28 81.23,62.28 IC22.2 | v2.9,54.2 3.81,53.29 3.81,34.85 4.72,33.93 15.09,33.93 16.15,32.87 16.15,31.34 17.37,30.12 19.36,30.12 21.49,27.99 S5.1A | v2.9,60.3 2.9,64.41 4.12,65.63 4.12,68.83 5.33,70.05 5.33,71.88 6.71,73.25 6.71,74.78 11.89,79.96 31.09,79.96 31.7,80.57 41.15,80.57 46.18,75.54 49.68,75.54 51.05,74.17 51.05,68.83 52.27,67.61 52.73,67.61 53.19,67.16 53.8,67.16 54.25,67.61 55.63,67.61 57.15,66.09 IC21.2
N$81  (via drill 0.35)
  Top 0.152: v82.6,74.47 83.36,75.23 89.31,75.23 90.53,74.02 90.53,72.64 v91.44,71.73 | v57.91,7.72 57.3,7.11 8.69,7.11 2.44,13.36 2.44,17.78 S6.0B
  Bottom 0.152: v82.6,74.47 82.6,72.95 83.52,72.03 83.67,72.03 85.8,69.9 86.26,69.9 IC22.13 | v91.44,71.73 91.75,71.42 91.9,71.42 92.96,70.36 92.96,68.83 94.18,67.61 94.34,67.61 95.56,66.4 95.56,57.4 97.84,55.12 97.84,49.02 97.38,48.56 97.38,44.3 97.54,44.14 97.54,31.34 87.63,21.44 87.63,17.93 84.89,15.19 80.16,15.19 73.3,8.33 58.52,8.33 v57.91,7.72
N$82  (via drill 0.35)
  Top 0.152: v82.6,57.56 82.6,59.23 83.97,60.6 v84.58,60.6
  Bottom 0.152: v82.6,57.56 81.53,56.49 81.53,54.2 80.31,52.98 78.94,52.98 77.72,51.77 77.72,49.17 76.5,47.95 76.5,47.35 74.22,45.06 68.58,45.06 67.67,45.97 67.67,47.35 66.45,48.56 66.29,48.56 65.08,49.78 65.08,51.16 63.86,52.38 61.27,52.38 59.74,53.9 59.74,62.13 IC23.2 | v84.58,60.6 84.58,61.06 85.34,61.82 85.34,63.19 85.95,63.8 86.72,63.8 87.33,63.19 87.33,58.01 88.54,56.79 89.31,56.79 89.92,57.4 89.92,68.83 IC22.12
N$83  (via drill 0.35)
  Top 0.152: v77.42,68.99 76.05,67.61 74.52,67.61 73.91,67 73.91,65.63 72.69,64.41 67.51,64.41 65.38,62.28 64.77,62.28 IC23.4 | v79.25,72.34 80.62,72.34 80.92,72.03 89.31,72.03 91.44,69.9 IC22.11
  Bottom 0.152: v77.42,68.99 77.42,70.51 v79.25,72.34
N$84  (via drill 0.35)
  Top 0.152: v54.41,14.27 66.45,14.27 68.58,12.14 72.08,12.14 72.54,12.6 81.08,12.6 v82.3,13.82 | v96.77,13.51 96.77,13.97 98.91,16.1 98.91,73.25 94.49,77.67 76.81,77.67 76.5,77.98 75.89,77.98 v75.29,77.37 | v75.89,71.73 75.89,70.81 IC23.9
  Bottom 0.152: v54.41,14.27 50.9,17.78 DIS3.7 | v82.3,13.82 91.9,13.82 92.96,14.88 95.4,14.88 v96.77,13.51 | v75.29,77.37 75.29,75.23 75.89,74.62 v75.89,71.73
N$85  (via drill 0.35)
  Top 0.152: v57.61,29.06 58.52,29.97 58.67,29.97 59.44,30.73 59.44,36.98 v59.13,37.29 | v57.3,37.29 57.3,37.59 56.84,38.05 56.84,51.77 55.63,52.98 55.47,52.98 54.86,53.59 54.86,55.58 56.08,56.79 56.24,56.79 56.84,57.4 56.84,60.15 55.93,61.06 55.93,74.47 56.84,75.39 v64.01,75.39
  Bottom 0.152: v57.61,29.06 56.69,28.14 56.69,26.16 48.31,17.78 DIS3.6 | v57.3,37.29 v59.13,37.29 | v64.01,75.39 67.51,75.39 68.89,74.02 68.89,72.64 70.1,71.42 70.87,71.42 72.39,69.9 IC23.10
N$86  (via drill 0.35)
  Top 0.152: v68.28,13.82 68.28,14.27 71.48,17.47 71.48,19.91 75.44,23.88 v75.44,27.08 | v77.72,29.36 77.72,38.96 v79.4,40.64 | v85.8,60.3 85.8,60.76 85.34,61.21 85.34,63.19 84.43,64.11 78.03,64.11 76.66,62.74 v76.2,62.74
  Bottom 0.152: v68.28,13.82 64.16,9.7 58.06,9.7 50.9,2.54 DIS3.4 | v77.72,29.36 v75.44,27.08 | v79.4,40.64 83.21,40.64 84.73,42.16 84.73,45.36 84.12,45.97 84.12,49.17 84.73,49.78 84.73,52.98 84.12,53.59 84.12,55.58 85.34,56.79 85.34,59.84 v85.8,60.3 | v76.2,62.74 75.89,63.04 75.89,63.19 74.98,64.11 74.37,64.11 73.3,65.18 73.3,67.16 72.24,68.22 71.48,68.22 IC23.11
N$87  (via drill 0.35)
  Top 0.152: v82.91,8.03 90.37,8.03 98.6,16.26 98.6,46.74 95.25,50.09 95.25,52.07 94.03,53.29 94.03,56.34 92.81,57.56 92.81,66.7 91.29,68.22 91.14,68.22 89.92,69.44 89.92,70.81 89,71.73 78.18,71.73 75.89,69.44 75.89,68.83 75.29,68.22 68.89,68.22 67.36,69.75 IC23.12
  Bottom 0.152: DIS3.2 56.39,2.54 61.87,8.03 v82.91,8.03
N$88  (via drill 0.35)
  Top 0.152: v81.38,7.42 86.11,12.14 93.57,12.14 v97.99,16.56 | v72.08,78.28 v91.29,78.28 | v60.96,65.33 61.87,64.41 62.64,64.41 63.55,65.33 v63.55,67
  Bottom 0.152: DIS3.1 62.79,2.54 67.67,7.42 v81.38,7.42 | v97.99,16.56 97.99,25.55 98.91,26.47 98.91,69.44 96.32,72.03 96.16,72.03 94.94,73.25 94.94,74.62 v91.29,78.28 | v72.08,78.28 64.31,78.28 63.09,77.06 62.18,77.06 60.96,75.84 v60.96,65.33 | v63.55,67 63.55,68.53 64.77,69.75 IC23.13
N$89  (via drill 0.35)
  Top 0.152: DIS3.9 56.39,17.78 58.52,19.91 63.86,19.91 64.47,20.52 64.47,28.3 v60.05,32.71 | v62.03,38.66 62.03,41.71 61.87,41.86 61.87,55.73 v61.11,56.49 | v60.96,61.52 60.96,62.89 59.44,64.41 59.28,64.41 58.67,65.02 58.67,67 59.59,67.92 61.72,67.92 62.03,68.22 62.64,68.22 63.25,68.83 63.25,70.81 62.64,71.42 61.27,71.42 IC23.15
  Bottom 0.152: v60.05,32.71 62.03,34.7 v62.03,38.66 | v61.11,56.49 60.81,56.79 60.66,56.79 60.05,57.4 60.05,60.6 v60.96,61.52
N$90
  Top 0.152: DIS3.10 59.89,17.78 61.72,19.61 64.01,19.61 64.77,20.37 64.77,28.45 60.66,32.56 60.66,33.93 59.74,34.85 59.74,60.15 58.37,61.52 58.37,67.16 59.44,68.22 60.66,68.22 62.18,69.75 IC23.14
N$91  (via drill 0.35)
  Top 0.152: v62.64,37.13 60.05,39.73 60.05,59.54 62.18,61.67 62.18,62.13 IC23.3 | v60.2,31.65 60.2,31.34 60.66,30.89 60.66,26.47 v58.06,23.88 | v44.04,14.27 44.04,11.84 v46.48,9.4
  Bottom 0.152: v62.64,37.13 62.64,36.68 62.33,36.37 62.33,33.78 v60.2,31.65 | v58.06,23.88 54.86,23.88 49.23,18.24 49.23,16.71 46.79,14.27 v44.04,14.27 | v46.48,9.4 16,9.4 S6.1B
N$92  (via drill 0.35)
  Top 0.152: v73.61,48.87 73.91,48.56 74.07,48.56 76.5,46.13 76.5,45.97 77.72,44.76 79.1,44.76 79.7,44.14 79.7,41.86 77.27,39.42 77.27,29.82 77.11,29.67 77.11,27.84 78.18,26.77 v78.18,23.11 | v64.92,15.04 50.75,15.04 v48.16,12.45
  Bottom 0.152: v73.61,48.87 72.08,50.39 72.08,55.58 71.48,56.19 71.32,56.19 70.1,57.4 70.1,58.93 67.36,61.67 67.36,62.13 IC23.5 | v78.18,23.11 78.18,20.98 76.66,19.46 69.49,19.46 68.28,18.24 68.28,16.71 66.6,15.04 v64.92,15.04 | v48.16,12.45 33.22,12.45 27.74,17.93 27.74,18.85 26.52,20.07 21.64,20.07 16.92,24.79 10.67,24.79 7.62,27.84 S6.1A
N$93  (via drill 0.35)
  Top 0.152: v39.01,71.73 39.01,71.42 38.41,70.81 38.41,61.82 36.88,60.3 v36.58,60.3 | v36.58,56.95 36.58,53.59 35.66,52.68 35.05,52.68 34.29,51.92 v34.29,42.47 | v40.23,39.88 40.23,39.42 39.01,38.2 39.01,28.6 v38.86,28.45 | v38.86,16.1 46.33,8.64 69.95,8.64 72.08,10.77 73.15,10.77 73.46,10.46 73.46,8.64 67.36,2.54 DIS2.4
  Bottom 0.152: v39.01,71.73 37.19,73.56 36.88,73.56 IC18.11 | v36.58,56.95 v36.58,60.3 | v34.29,42.47 36.88,39.88 v40.23,39.88 | v38.86,16.1 v38.86,28.45
N$94  (1 unrouted)
N$95  (via drill 0.35)
  Top 0.152: v70.41,79.96 v87.17,79.96 | v58.98,77.52 v61.42,79.96 | v43.28,77.37 v45.26,77.37 | v40.69,78.44 38.86,78.44 38.56,78.13 35.81,78.13 v33.83,76.15
  Bottom 0.152: DIS2.1 83.06,2.54 83.36,2.23 94.34,2.23 97.38,5.28 97.38,25.4 98.6,26.62 98.6,65.94 96.32,68.22 96.16,68.22 94.94,69.44 94.94,70.81 93.73,72.03 93.57,72.03 92.35,73.25 92.35,74.78 v87.17,79.96 | v61.42,79.96 v70.41,79.96 | v58.98,77.52 45.41,77.52 v45.26,77.37 | v43.28,77.37 41.76,77.37 v40.69,78.44 | v33.83,76.15 31.85,74.17 31.85,73.71 IC18.13
N$96  (via drill 0.35)
  Top 0.152: DIS2.9 72.39,16.41 v69.04,13.06 | v57,7.72 8.53,7.72 2.74,13.51 2.74,15.95 4.27,17.47 4.27,24.18 1.52,26.92 1.52,40.34 2.74,41.55 2.9,41.55 3.5,42.16 v3.5,54.97 | v7.47,58.93 v6.25,57.71
  Bottom 0.152: v69.04,13.06 67.97,13.06 63.55,8.64 57.91,8.64 v57,7.72 | v6.25,57.71 v3.5,54.97 | v7.47,58.93 7.47,59.54 11.73,63.8 11.73,68.38 14.33,70.97 14.33,74.78 16.31,76.76 19.2,76.76 23.16,72.8 23.16,72.64 23.77,72.03 24.54,72.03 26.06,73.56 26.67,73.56 IC18.15
N$97  (via drill 0.35)
  Top 0.152: v21.95,67.92 21.49,67.92 20.57,68.83 20.57,70.81 19.36,72.03 19.36,74.62 19.96,75.23 27.13,75.23 28.65,73.71 29.11,73.71 IC18.14 | v16.46,59.08 16.46,57.86 16,57.4 16,56.34 16.46,55.88 16.46,50.09 16.15,49.78 15.54,49.78 14.02,51.31 13.41,51.31 12.04,49.94 12.04,48.26 11.73,47.95 11.73,45.97 12.95,44.76 13.11,44.76 14.33,43.54 14.33,27.99 v16.92,25.4 | v30.02,16.56 38.41,16.56 38.56,16.71 42.52,16.71 48.01,11.23 v71.17,11.23
  Bottom 0.152: v21.95,67.92 21.95,65.63 19.96,63.65 19.96,61.21 18.75,60 17.37,60 v16.46,59.08 | v16.92,25.4 19.36,25.4 24.38,20.37 26.67,20.37 30.02,17.02 v30.02,16.56 | v71.17,11.23 71.17,14.12 74.83,17.78 DIS2.10
N$98
  Top 0.152: IC17.5 11.43,69.75 14.02,69.75 16.76,67 16.76,64.41 18.14,63.04 18.14,60 18.75,59.39 18.75,18.09 20.27,16.56 20.27,13.97 C2.2
N$99
  Top 0.152: R3.1 R1.2 10.06,59.69 10.06,62.43 9.14,63.35 9.14,66.55 6.4,69.29 6.4,69.75 IC17.7
N$100
  Top 0.152: IC17.2 5.18,61.06 5.18,59.69 R1.1 5.03,59.69 4.12,58.78 4.12,30.73 4.88,29.97 4.88,23.11 6.25,21.74 6.25,13.97 C1.2
  Bottom 0.152: IC17.6 8.84,69.75 8.84,64.87 6.25,62.28 IC17.2
N$101  (via drill 0.35)  (1 unrouted)
  Top 0.152: v12.8,70.36 13.87,70.36 17.68,66.55 17.68,66.09 | v57.45,56.49 57.45,49.78 58.37,48.87 58.37,47.04 IC5.2 | v53.49,67.77 v53.49,63.5 | v64.31,77.22 v60.5,77.22 60.2,76.91 58.67,76.91 57.61,77.98 42.98,77.98 42.22,77.22 40.39,77.22 39.93,76.76 v37.95,76.76 | v80.01,69.44 80.01,69.14 81.53,67.61 84.73,67.61 86.26,66.09 | v26.82,77.22 28.65,79.05 v32.92,79.05
  Bottom 0.152: IC17.3 8.99,62.28 8.99,62.89 11.43,65.33 11.43,68.53 12.8,69.9 v12.8,70.36 12.8,71.73 14.02,72.95 14.02,74.93 16.31,77.22 v26.82,77.22 | v57.45,56.49 57.45,58.78 55.63,60.6 54.25,60.6 53.49,61.37 v53.49,63.5 | v53.49,67.77 53.49,74.47 55.93,76.91 60.2,76.91 v60.5,77.22 | v64.31,77.22 72.69,77.22 73.46,77.98 76.5,77.98 80.01,74.47 v80.01,69.44 | v32.92,79.05 35.97,79.05 37.95,77.06 v37.95,76.76
VCC  (via drill 0.35)  (2 unrouted)
  Top 0.152: 12.8,40.95 12.8,39.42 IC9.15 | 12.8,40.95 12.8,43.08 IC12.16 | IC9.16 IC12.15 | IC3.16 17.83,58.32 17.83,54.66 IC15.15 | 12.8,40.95 11.12,40.95 10.82,41.25 10.82,41.86 11.12,42.16 11.12,49.17 10.82,49.48 10.82,50.09 15.24,54.51 IC15.16 | 20.32,73.66 20.42,73.71 24.08,73.71 IC18.16 | 13.41,60.15 11.43,62.13 IC17.4 | 13.41,60.15 13.87,59.69 R3.2 | IC17.8 3.81,69.29 6.71,66.4 6.71,63.65 7.92,62.43 7.92,60.6 9.75,58.78 12.04,58.78 13.41,60.15 | IC4.16 77.57,54.51 77.57,53.9 79.7,51.77 79.7,49.33 80.92,48.11 80.92,46.13 83.82,43.23 IC10.15 83.82,43.08 84.43,42.47 v84.43,40.95 | 42.52,54.66 43.13,54.66 IC14.15 | 42.52,54.66 40.69,54.66 IC14.16 | v43.28,41.25 42.98,41.55 42.82,41.55 42.22,42.16 42.22,53.44 42.52,53.75 42.52,54.66 | 62.23,73.66 62.18,73.71 59.74,73.71 IC21.14 | IC23.16 57.15,68.07 56.24,67.16 56.24,61.21 58.37,59.08 58.37,58.47 IC16.16 58.37,58.32 55.93,55.88 55.93,54.66 IC5.16 55.93,54.51 57.15,53.29 57.15,46.28 58.37,45.06 58.37,43.23 IC11.16 58.37,43.08 57.61,42.32 v57.61,38.2 | v48.01,38.81 47.09,39.73 47.09,41.86 46.79,42.16 46.63,42.16 45.72,43.08 IC1.16 | v65.53,76 66.14,75.39 74.07,75.39 74.83,76.15 76.96,76.15 79.4,73.71 81.23,73.71 IC6.14 | v27.74,77.22 32,77.22 34.75,79.96 v58.52,79.96
  Bottom 0.152: IC9.15 12.8,39.42 15.24,39.42 IC9.16 | IC15.16 15.24,54.66 17.68,54.66 IC15.15 | 14.02,59.69 14.02,61.67 16.15,63.8 16.15,66.4 17.53,67.77 17.53,70.36 20.27,73.1 20.27,73.56 20.32,73.66 | 14.02,59.69 15.24,58.47 17.68,58.47 IC3.16 | 14.02,59.69 R3.2 | 81.69,68.22 80.31,68.22 78.79,69.75 IC22.16 | 81.69,68.22 82.3,68.83 82.3,72.64 IC6.14 75.59,79.35 60.35,79.35 59.74,79.96 v58.52,79.96 | v84.43,40.95 86.26,42.77 86.26,43.08 IC10.16 | 81.69,68.22 81.69,67.61 82.91,66.4 82.91,61.21 84.12,60 84.28,60 84.73,59.54 84.73,56.64 83.82,55.73 83.82,52.83 82.91,51.92 82.91,48.56 83.82,47.65 IC10.15 | v43.28,41.25 45.11,43.08 45.72,43.08 IC1.16 | IC2.16 38.1,57.1 40.54,54.66 IC14.16 | IC23.16 57.15,71.12 IC21.14 | IC11.16 58.52,43.23 60.96,43.23 IC11.15 | v48.01,38.81 51.66,38.81 52.27,38.2 v57.61,38.2 | v65.53,76 64.47,76 63.7,76.76 62.33,76.76 61.87,76.3 61.87,74.02 62.23,73.66 | v27.74,77.22 24.23,73.71 IC18.16
VDD  (via drill 0.35)
  Top 0.152: v76.2,77.37 92.2,77.37 94.94,74.62 94.94,73.25 96.16,72.03 96.32,72.03 97.54,70.81 97.54,68.83 96.93,68.22 96.77,68.22 95.56,67 95.56,61.21 96.47,60.3 96.47,58.47 IC13.16 | v75.89,75.54 74.83,75.54 73.3,74.02 73.3,72.64 72.69,72.03 56.84,72.03 v56.54,71.73 | v15.85,50.39 16.15,50.7 16.15,55.73 15.7,56.19 15.7,59.23 17.53,61.06 17.53,63.19 16.46,64.26 16.46,66.85 14.78,68.53 11.43,68.53 10.52,69.44 10.52,70.21 11.28,70.97 13.72,70.97 14.78,69.9 16.46,69.9 IC8.16 | v39.62,33.93 39.62,37.13 39.32,37.44 39.32,38.05 v41.3,40.03 | v48.01,41.25 48.31,41.25 49.38,42.32 49.38,56.64 49.84,57.1 49.84,59.39 51.05,60.6 51.05,67 52.27,68.22 53.03,68.22 54.56,69.75 IC7.16
  Bottom 0.152: v76.2,77.37 76.2,75.84 v75.89,75.54 | v56.54,71.73 54.71,69.9 IC7.16 | v15.85,50.39 15.85,49.63 14.33,48.11 14.33,42.16 15.54,40.95 15.7,40.95 16.76,39.88 16.76,38.35 17.37,37.74 20.12,37.74 21.95,35.92 21.95,34.54 22.55,33.93 v39.62,33.93 | v41.3,40.03 45.57,40.03 46.18,40.64 47.4,40.64 v48.01,41.25
VEE
  Bottom 0.152: IC16.7 73.61,50.85 73.61,52.68 72.39,53.9 IC23.7 72.39,62.28 70.56,64.11 41.91,64.11 40.08,65.94 39.47,65.94 IC18.7
VSS  (via drill 0.35)
  Top 0.152: IC8.8 34.29,62.28 36.73,62.28 IC7.8 38.1,63.5 v38.1,71.42 | v83.67,20.98 83.36,21.29 83.36,27.38 82.91,27.84 82.91,36.37 80.31,38.96 80.31,44.45 79.1,45.67 79.1,47.8 78.79,48.11 78.79,50.7 IC13.8 | v72.85,10.16 71.93,10.16 70.1,8.33 24.38,8.33 v21.03,11.68 | v17.07,15.19 14.02,18.24 14.02,19.15 10.97,22.2 10.97,24.18 13.72,26.92 13.72,32.71 12.5,33.93 12.34,33.93 v11.43,34.85 | v11.43,49.78 v11.43,41.55 | v11.43,51.92 11.43,55.42 15.85,59.84 v15.85,60.3
  Bottom 0.152: v72.85,10.16 v83.67,20.98 | v21.03,11.68 18.9,13.82 18.9,14.43 18.14,15.19 v17.07,15.19 | v11.43,41.55 v11.43,34.85 | v11.43,51.92 v11.43,49.78 | v15.85,60.3 16.61,60.3 18.14,61.82 18.14,64.41 19.36,65.63 19.36,68.22 20.57,69.44 20.57,70.81 21.18,71.42 30.94,71.42 31.24,71.73 37.8,71.73 v38.1,71.42

## Text on the board
Top: TEAM SSS